# Altium schematic sheet microcontroller.SchDoc
size A4; SheetNumber: 4; SheetTotal: 6
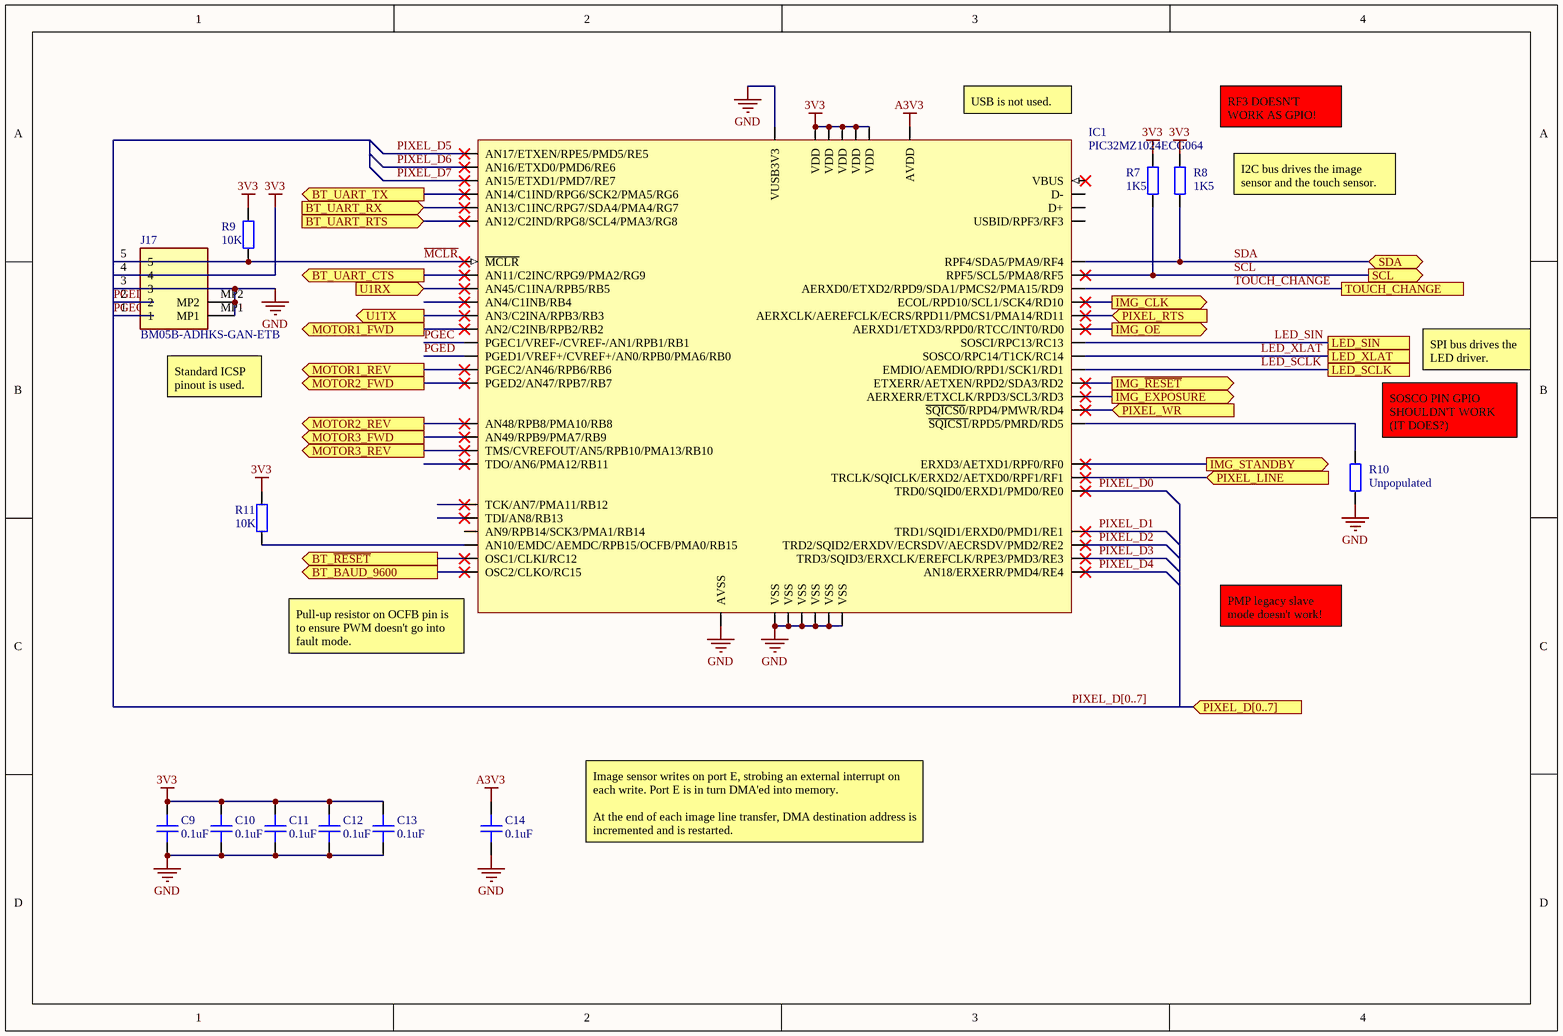
[diagram p0: microcontroller.SchDoc]

## Parts
C9  0.1uF  [1608[0603]_M]
C10  0.1uF  [1608[0603]_M]
C11  0.1uF  [1608[0603]_M]
C12  0.1uF  [1608[0603]_M]
C13  0.1uF  [1608[0603]_M]
C14  0.1uF  [1608[0603]_M]
IC1  PIC32MZ1024ECG064  [TQFP-64_M]
J17  BM05B-ADHKS-GAN-ETB  [BM05BADHKSGANETB]
R7  1K5  [1608[0603]_M]
R8  1K5  [1608[0603]_M]
R9  10K  [1608[0603]_M]
R10  Unpopulated  [1608[0603]_M]
R11  10K  [1608[0603]_M]

## Ports
BT_BAUD_9600 (out), BT_UART_CTS (out), BT_UART_RTS (in), BT_UART_RX (in), BT_UART_TX (out), BT_~{RESET} (out), IMG_CLK (out), IMG_EXPOSURE (out), IMG_OE (out), IMG_STANDBY (out), IMG_~{RESET} (out), LED_SCLK, LED_SIN, LED_XLAT, MOTOR1_FWD (out), MOTOR1_REV (out), MOTOR2_FWD (out), MOTOR2_REV (out), MOTOR3_FWD (out), MOTOR3_REV (out), PIXEL_D[0..7] (in), PIXEL_LINE (in), PIXEL_RTS (in), PIXEL_WR (in), SCL (out), SDA (bidir), TOUCH_CHANGE, U1RX (in), U1TX (out)

## Nets
3V3: C9.2 C10.2 C11.2 C12.2 C13.2 IC1.8(VDD) IC1.26(VDD) IC1.39(VDD) IC1.54(VDD) IC1.60(VDD) J17.4 R7.2 R8.2 R9.2 R11.2
A3V3: C14.2 IC1.19(AVDD)
GND: C9.1 C10.1 C11.1 C12.1 C13.1 C14.1 IC1.7(VSS) IC1.20(AVSS) IC1.25(VSS) IC1.34(VUSB3V3) IC1.35(VSS) IC1.40(VSS) IC1.55(VSS) IC1.59(VSS) J17.3 J17.MP1 J17.MP2 R10.1
BT_BAUD_9600: IC1.32(OSC2/CLKO/RC15) ; port BT_BAUD_9600
BT_~{RESET}: IC1.31(OSC1/CLKI/RC12) ; port BT_~{RESET}
BT_UART_CTS: IC1.10(AN11/C2INC/RPG9/PMA2/RG9) ; port BT_UART_CTS
BT_UART_RTS: IC1.6(AN12/C2IND/RPG8/SCL4/PMA3/RG8) ; port BT_UART_RTS
BT_UART_RX: IC1.5(AN13/C1INC/RPG7/SDA4/PMA4/RG7) ; port BT_UART_RX
BT_UART_TX: IC1.4(AN14/C1IND/RPG6/SCK2/PMA5/RG6) ; port BT_UART_TX
IMG_CLK: IC1.44(ECOL/RPD10/SCL1/SCK4/RD10) ; port IMG_CLK
IMG_EXPOSURE: IC1.51(AERXERR/ETXCLK/RPD3/SCL3/RD3) ; port IMG_EXPOSURE
IMG_OE: IC1.46(AERXD1/ETXD3/RPD0/RTCC/INT0/RD0) ; port IMG_OE
IMG_~{RESET}: IC1.50(ETXERR/AETXEN/RPD2/SDA3/RD2) ; port IMG_~{RESET}
IMG_STANDBY: IC1.56(ERXD3/AETXD1/RPF0/RF0) ; port IMG_STANDBY
LED_SCLK: IC1.49(EMDIO/AEMDIO/RPD1/SCK1/RD1) ; port LED_SCLK
LED_SIN: IC1.47(SOSCI/RPC13/RC13) ; port LED_SIN
LED_XLAT: IC1.48(SOSCO/RPC14/T1CK/RC14) ; port LED_XLAT
~{MCLR}: IC1.9(~{MCLR}) J17.5 R9.1
MOTOR1_FWD: IC1.14(AN2/C2INB/RPB2/RB2) ; port MOTOR1_FWD
MOTOR1_REV: IC1.17(PGEC2/AN46/RPB6/RB6) ; port MOTOR1_REV
MOTOR2_FWD: IC1.18(PGED2/AN47/RPB7/RB7) ; port MOTOR2_FWD
MOTOR2_REV: IC1.21(AN48/RPB8/PMA10/RB8) ; port MOTOR2_REV
MOTOR3_FWD: IC1.22(AN49/RPB9/PMA7/RB9) ; port MOTOR3_FWD
MOTOR3_REV: IC1.23(TMS/CVREFOUT/AN5/RPB10/PMA13/RB10) ; port MOTOR3_REV
PGEC: IC1.15(PGEC1/VREF-/CVREF-/AN1/RPB1/RB1) J17.1
PGED: IC1.16(PGED1/VREF+/CVREF+/AN0/RPB0/PMA6/RB0) J17.2
PIXEL_D0: IC1.58(TRD0/SQID0/ERXD1/PMD0/RE0)
PIXEL_D1: IC1.61(TRD1/SQID1/ERXD0/PMD1/RE1)
PIXEL_D2: IC1.62(TRD2/SQID2/ERXDV/ECRSDV/AECRSDV/PMD2/RE2)
PIXEL_D3: IC1.63(TRD3/SQID3/ERXCLK/EREFCLK/RPE3/PMD3/RE3)
PIXEL_D4: IC1.64(AN18/ERXERR/PMD4/RE4)
PIXEL_D5: IC1.1(AN17/ETXEN/RPE5/PMD5/RE5)
PIXEL_D6: IC1.2(AN16/ETXD0/PMD6/RE6)
PIXEL_D7: IC1.3(AN15/ETXD1/PMD7/RE7)
PIXEL_LINE: IC1.57(TRCLK/SQICLK/ERXD2/AETXD0/RPF1/RF1) ; port PIXEL_LINE
PIXEL_RTS: IC1.45(AERXCLK/AEREFCLK/ECRS/RPD11/PMCS1/PMA14/RD11) ; port PIXEL_RTS
PIXEL_WR: IC1.52(~{SQICS0}/RPD4/PMWR/RD4) ; port PIXEL_WR
SCL: IC1.42(RPF5/SCL5/PMA8/RF5) R7.1 ; port SCL
SDA: IC1.41(RPF4/SDA5/PMA9/RF4) R8.1 ; port SDA
TOUCH_~{CHANGE}: IC1.43(AERXD0/ETXD2/RPD9/SDA1/PMCS2/PMA15/RD9) ; port TOUCH_CHANGE
U1RX: IC1.11(AN45/C1INA/RPB5/RB5) ; port U1RX
U1TX: IC1.13(AN3/C2INA/RPB3/RB3) ; port U1TX
NetIC1_30: IC1.30(AN10/EMDC/AEMDC/RPB15/OCFB/PMA0/RB15) R11.1
NetIC1_53: IC1.53(~{SQICS1}/RPD5/PMRD/RD5) R10.2

Not connected (* = marked no-connect by the designer): IC1 12(AN4/C1INB/RB4)* 24(TDO/AN6/PMA12/RB11)* 27(TCK/AN7/PMA11/RB12)* 28(TDI/AN8/RB13)* 29(AN9/RPB14/SCK3/PMA1/RB14) 33(VBUS)* 36(D-) 37(D+) 38(USBID/RPF3/RF3)

## Buses and harness runs
bus PIXEL_D[0..7] = port PIXEL_D[0..7]

## Notes on the sheet
- (near IC1) USB is not used.
- RF3 DOESN'T WORK AS GPIO!
- I2C bus drives the image sensor and the touch sensor.
- SPI bus drives the LED driver.
- (near J17) Standard ICSP pinout is used.
- (near R10) SOSCO PIN GPIO SHOULDN'T WORK (IT DOES?)
- (near IC1) Pull-up resistor on OCFB pin is to ensure PWM doesn't go into fault mode.
- PMP legacy slave mode doesn't work!
- Image sensor writes on port E, strobing an external interrupt on each write. Port E is in turn DMA'ed into memory.
  At the end of each image line transfer, DMA destination address is incremented and is restarted.

## Library data of the parts
C9-C14 = Capacitor: Generic Capacitor; Value: 0.1uF
IC1 = CMP-042-000001-1: 32-bit Microcontroller; Source: PIC.SchLib; Design Item ID: PIC32MZ1024ECG064
J17 = BM05B-ADHKS-GAN-ETB: Connector; Manufacturer_Name: JST (JAPAN SOLDERLESS TERMINALS); Datasheet Link: http://www.jst-mfg.com/product/pdf/eng/eADH.pdf?5efba42839880; Height: 1.9mm; Manufacturer_Part_Number: BM05B-ADHKS-GAN-ETB
R7-R11 = Resistor: Generic Resistor
  R7 R8: Value: 1K5
  R9 R11: Value: 10K
  R10: Value: Unpopulated